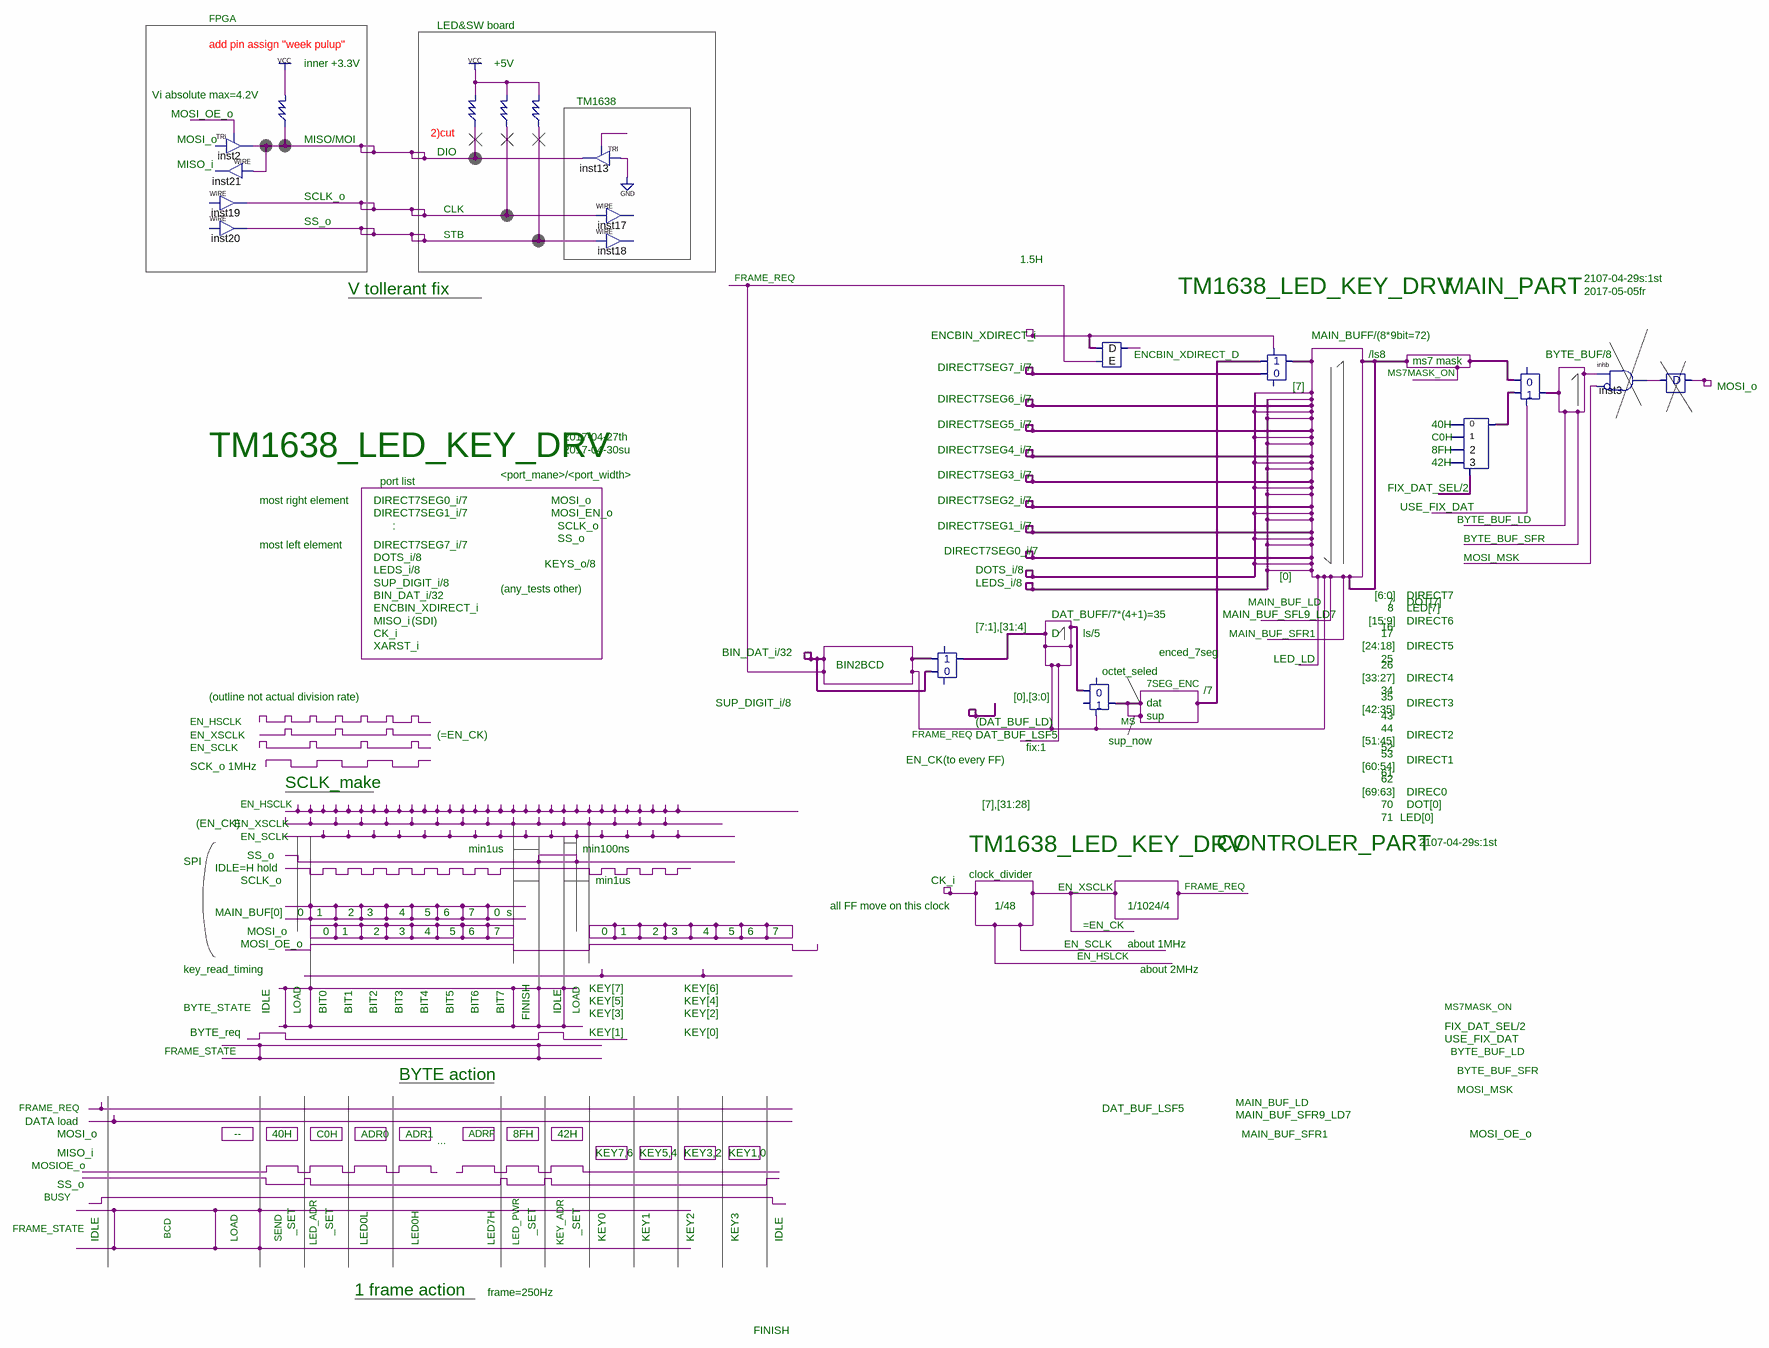
[diagram p0: schematic sheet]
// Quartus schematic TM1638_LED_KEY_DRV.bdf as structural Verilog: 19 symbols, 0 pins
module TM1638_LED_KEY_DRV (
);

  wire inst2_out, inst3_1, inst5_y, inst6_y, inst7_y, inst8_y, inst10_y, inst11_y, inst19_out, inst20_out,
       inst22_y, inst_y, undriven, undriven_2, undriven_3, undriven_4, undriven_5, undriven_6, undriven_7;

  // WIRE inst19 has open pins
  // WIRE inst20 has open pins
  TRI inst2 (.OE(undriven_2), .OUT(inst2_out));  // open: IN
  // WIRE inst21 has open pins
  R inst8 (.A(inst2_out), .Y(inst8_y));
  R inst11 (.A(inst2_out), .Y(inst11_y));
  R inst15 (.A(inst19_out), .Y(inst11_y));
  R inst16 (.A(inst20_out), .Y(inst11_y));
  TRI inst13 (.IN(1'b0), .OE(undriven), .OUT(inst2_out));
  // WIRE inst17 has open pins
  // WIRE inst18 has open pins
  \2_1sel  inst22 (.A(inst22_y), .B(inst22_y), .Y(inst22_y));  // open: S0, S1
  DE inst10 (.D(undriven_7), .E(inst22_y), .Y(inst10_y));
  \2_1sel  inst5 (.B(inst22_y), .S0(inst22_y), .Y(inst5_y));  // open: A, S1
  \2_1sel  inst4 (.A(inst5_y), .B(undriven_3), .S0(undriven_7), .Y(inst22_y));  // open: S1
  \4_1sel  inst (.S(undriven_5), .Y(inst_y));  // open: A, B, C, 3
  \2_1sel  inst6 (.A(inst_y), .B(inst22_y), .S0(undriven_6), .Y(inst6_y));  // open: S1
  inhb inst3 (.\2 (inst6_y), .\3 (undriven_4), .\1 (inst3_1));
  D inst7 (.A({8{inst3_1}}), .Y(inst7_y));
  // also tied to VCC on the sheet: {inst11_y, inst8_y}

  // Notes on the sheet:
  //   FPGA
  //   LED&SW board
  //   add pin assign "week pulup"
  //   inner +3.3V
  //   +5V
  //   Vi absolute max=4.2V
  //   TM1638
  //   MOSI_OE_o
  //   2)cut
  //   MOSI_o
  //   MISO/MOI
  //   DIO
  //   MISO_i
  //   SCLK_o
  //   CLK
  //   SS_o
  //   STB
  //   1.5H
  //   FRAME_REQ
  //   TM1638_LED_KEY_DRV
  //   MAIN_PART
  //   2107-04-29s:1st
  //   V tollerant fix
  //   2017-05-05fr
  //   ENCBIN_XDIRECT_i
  //   MAIN_BUFF/(8*9bit=72)
  //   ENCBIN_XDIRECT_D
  //   /ls8
  //   BYTE_BUF/8
  //   ms7 mask
  //   DIRECT7SEG7_i/7
  //   MS7MASK_ON
  //   [7]
  //   MOSI_o
  //   DIRECT7SEG6_i/7
  //   DIRECT7SEG5_i/7
  //   40H
  //   TM1638_LED_KEY_DRV
  //   2017-04-27th
  //   C0H
  //   2017-04-30su
  //   DIRECT7SEG4_i/7
  //   8FH
  //   42H
  //   <port_mane>/<port_width>
  //   DIRECT7SEG3_i/7
  //   port list
  //   FIX_DAT_SEL/2
  //   most right element
  //   DIRECT7SEG0_i/7
  //   MOSI_o
  //   DIRECT7SEG2_i/7
  //   USE_FIX_DAT
  //   DIRECT7SEG1_i/7
  //   MOSI_EN_o
  //   BYTE_BUF_LD
  //   :
  //   SCLK_o
  //   DIRECT7SEG1_i/7
  //   SS_o
  //   BYTE_BUF_SFR
  //   most left element
  //   DIRECT7SEG7_i/7
  //   DIRECT7SEG0_i/7
  //   DOTS_i/8
  //   MOSI_MSK
  //   KEYS_o/8
  //   LEDS_i/8
  //   DOTS_i/8
  //   [0]
  //   SUP_DIGIT_i/8
  //   LEDS_i/8
  //   (any_tests other)
  //   BIN_DAT_i/32
  //   [6:0]
  //   DIRECT7
  //   MAIN_BUF_LD
  //   7
  //   DOT[7]
  //   ENCBIN_XDIRECT_i
  //   8
  //   LED[7]
  //   DAT_BUFF/7*(4+1)=35
  //   MAIN_BUF_SFL9_LD7
  //   MISO_i
  //   (SDI)
  //   [15:9]
  //   DIRECT6
  //   [7:1],[31:4]
  //   16
  //   CK_i
  //   D
  //   ls/5
  //   MAIN_BUF_SFR1
  //   17
  //   XARST_i
  //   [24:18]
  //   DIRECT5
  //   BIN_DAT_i/32
  //   enced_7seg
  //   LED_LD
  //   25
  //   BIN2BCD
  //   26
  //   octet_seled
  //   [33:27]
  //   DIRECT4
  //   7SEG_ENC
  //   /7
  //   34
  //   (outline not actual division rate)
  //   [0],[3:0]
  //   35
  //   SUP_DIGIT_i/8
  //   dat
  //   DIRECT3
  //   [42:35]
  //   sup
  //   43
  //   EN_HSCLK
  //   (DAT_BUF_LD)
  //   MS
  //   44
  //   EN_XSCLK
  //   (=EN_CK)
  //   FRAME_REQ
  //   DAT_BUF_LSF5
  //   DIRECT2
  //   sup_now
  //   [51:45]
  //   EN_SCLK
  //   fix:1
  //   52
  //   53
  //   EN_CK(to every FF)
  //   DIRECT1
  //   SCK_o
  //   1MHz
  //   [60:54]
  //   61
  //   SCLK_make
  //   62
  //   [69:63]
  //   DIREC0
  //   EN_HSCLK
  //   [7],[31:28]
  //   70
  //   DOT[0]
  //   71
  //   LED[0]
  //   (EN_CK)
  //   EN_XSCLK
  //   EN_SCLK
  //   TM1638_LED_KEY_DRV
  //   CONTROLER_PART
  //   2107-04-29s:1st
  //   min1us
  //   min100ns
  //   SS_o
  //   SPI
  //   IDLE=H hold
  //   clock_divider
  //   SCLK_o
  //   min1us
  //   CK_i
  //   EN_XSCLK
  //   FRAME_REQ
  //   all FF move on this clock
  //   1/48
  //   1/1024/4
  //   MAIN_BUF[0]
  //   0
  //   1
  //   2
  //   3
  //   4
  //   5
  //   6
  //   7
  //   0
  //   s
  //   =EN_CK
  //   MOSI_o
  //   0
  //   1
  //   2
  //   3
  //   4
  //   5
  //   6
  //   7
  //   0
  //   1
  //   2
  //   3
  //   4
  //   5
  //   6
  //   7
  //   MOSI_OE_o
  //   EN_SCLK
  //   about 1MHz
  //   EN_HSLCK
  //   key_read_timing
  //   about 2MHz
  //   FINISH
  //   KEY[7]
  //   KEY[6]
  //   IDLE
  //   LOAD
  //   BIT0
  //   BIT1
  //   BIT2
  //   BIT3
  //   BIT4
  //   BIT5
  //   BIT6
  //   BIT7
  //   IDLE
  //   LOAD
  //   KEY[5]
  //   KEY[4]
  //   BYTE_STATE
  //   MS7MASK_ON
  //   KEY[3]
  //   KEY[2]
  //   FIX_DAT_SEL/2
  //   BYTE_req
  //   KEY[1]
  //   KEY[0]
  //   USE_FIX_DAT
  //   FRAME_STATE
  //   BYTE_BUF_LD
  //   BYTE action
  //   BYTE_BUF_SFR
  //   MOSI_MSK
  //   MAIN_BUF_LD
  //   FRAME_REQ
  //   DAT_BUF_LSF5
  //   MAIN_BUF_SFR9_LD7
  //   DATA load
  //   MOSI_o
  //   --
  //   40H
  //   C0H
  //   ADR0
  //   ADR1
  //   ADRF
  //   8FH
  //   42H
  //   MAIN_BUF_SFR1
  //   MOSI_OE_o
  //   ...
  //   MISO_i
  //   KEY7,6
  //   KEY5,4
  //   KEY3,2
  //   KEY1,0
  //   MOSIOE_o
  //   SS_o
  //   BUSY
  //   LED_ADR
  //   LED_PWR
  //   KEY_ADR
  //   _SET
  //   _SET
  //   _SET
  //   _SET
  //   LED0L
  //   LED0H
  //   LED7H
  //   IDLE
  //   LOAD
  //   SEND
  //   KEY0
  //   KEY1
  //   KEY2
  //   KEY3
  //   IDLE
  //   BCD
  //   FRAME_STATE
  //   1 frame action
  //   frame=250Hz
  //   FINISH
endmodule
